# Altium schematic sheet FPGA_CONFIG.SchDoc
size A4
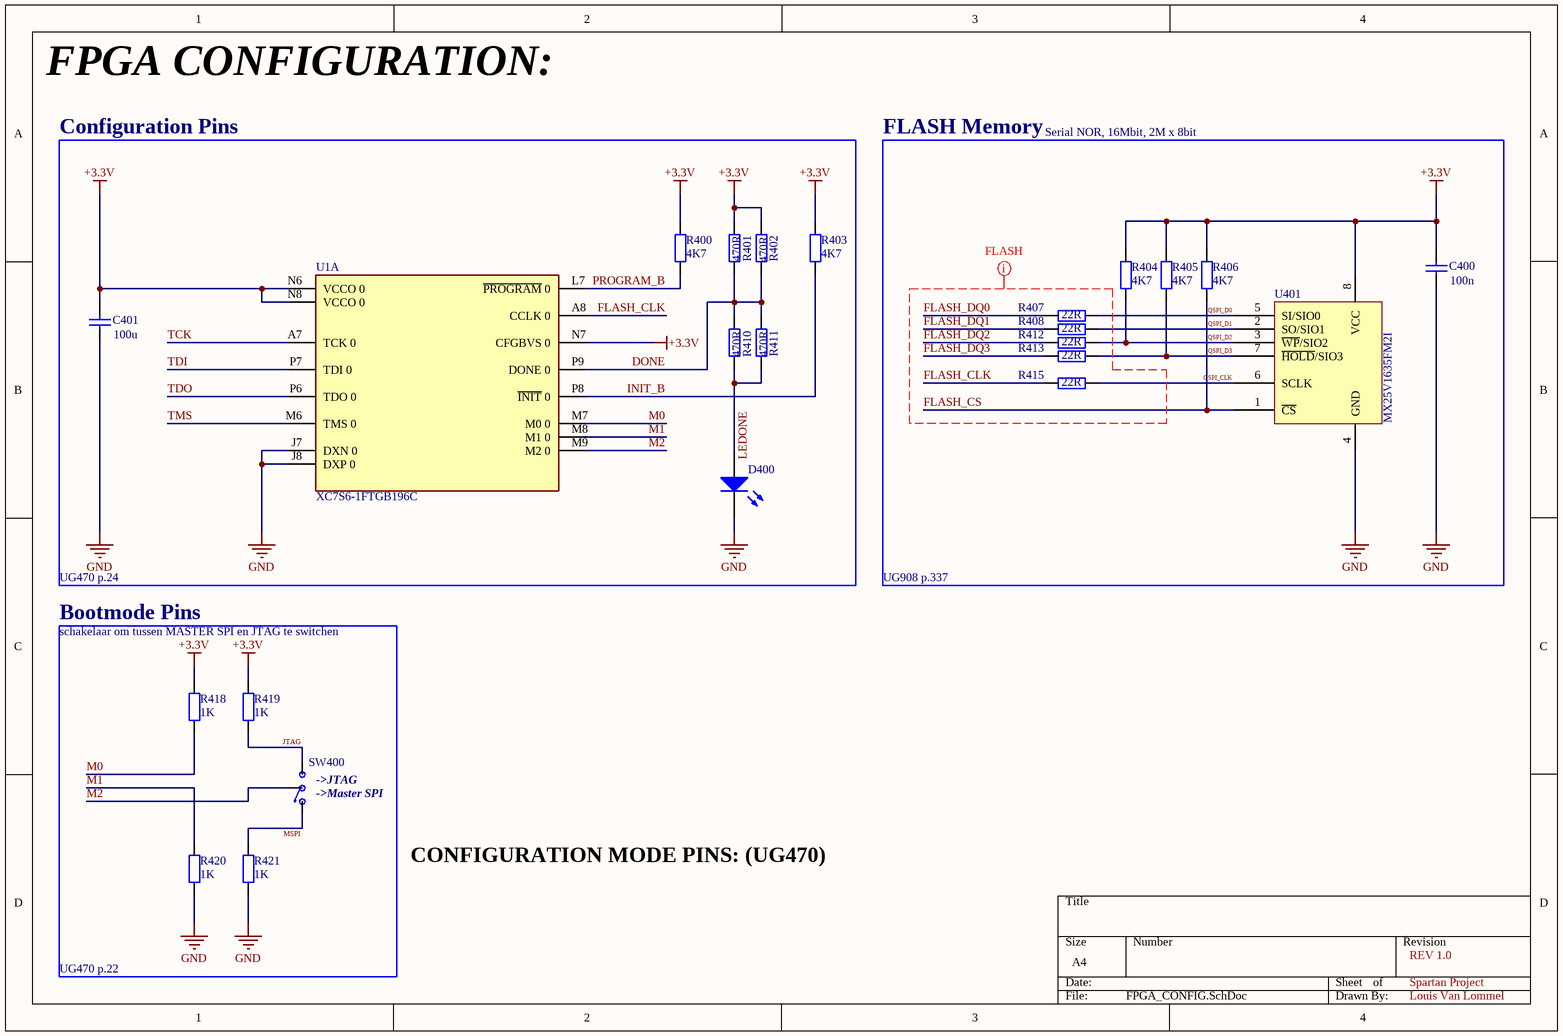
[diagram p0: FPGA_CONFIG.SchDoc]

## Parts
C400  100n  [CAP_0603]
C401  value 100u  [CAP_0805]  (hidden comment: 100uF)
D400  LED  [LED_0603]  (value not drawn)
R400  4K7  [RES_0603]
R401  value 470R  [RES_0603]  (hidden comment: 470)
R402  value 470R  [RES_0603]  (hidden comment: 470)
R403  4K7  [RES_0603]
R404  4K7  [RES_0603]
R405  4K7  [RES_0603]
R406  4K7  [RES_0603]
R407  value 22R  [RES_0603]  (hidden comment: 22)
R408  value 22R  [RES_0603]  (hidden comment: 22)
R410  value 470R  [RES_0603]  (hidden comment: 470)
R411  value 470R  [RES_0603]  (hidden comment: 470)
R412  value 22R  [RES_0603]  (hidden comment: 22)
R413  value 22R  [RES_0603]  (hidden comment: 22)
R415  value 22R  [RES_0603]  (hidden comment: 22)
R418  1K  [RES_0603]
R419  1K  [RES_0603]
R420  1K  [RES_0603]
R421  1K  [RES_0603]
SW400  SPDT SW  [SPDT SWITCH]  (value not drawn)
U1  XC7S6-1FTGB196C  [FP-XC7S6-1FTGB196C-MFG]  (part A of 4)
U401  MX25V1635FM2I  [SOP-8]

## Blocks framed on the sheet
Configuration Pins: C401 D400 R400-R403 R410 R411 U1
FLASH Memory: C400 R404-R408 R412 R413 R415 U401
Bootmode Pins: R418-R421 SW400

## Nets
+3.3V: C400.2 C401.2 R400.2 R401.2 R402.2 R403.2 R404.2 R405.2 R406.2 R418.2 R419.2 U1.N6(VCCO_0) U1.N7(CFGBVS_0) U1.N8(VCCO_0) U401.8(VCC)
GND: C400.1 C401.1 D400.2(K) R420.1 R421.1 U1.J7(DXN_0) U1.J8(DXP_0) U401.4(GND)
DONE: R401.1 R402.1 R410.2 R411.2 U1.P9(DONE_0)
FLASH_CLK: R415.2 U1.A8(CCLK_0)
FLASH_CS: R406.1 U401.1(~{CS})
FLASH_DQ0: R407.2
FLASH_DQ1: R408.2
FLASH_DQ2: R412.2
FLASH_DQ3: R413.2
INIT_B: R403.1 U1.P8(~{INIT}_0)
JTAG: R419.1 SW400.1
LEDONE: D400.1(A) R410.1 R411.1
M0: R418.1 U1.M7(M0_0)
M1: R420.2 U1.M8(M1_0)
M2: SW400.2 U1.M9(M2_0)
MSPI: R421.2 SW400.3
PROGRAM_B: R400.1 U1.L7(~{PROGRAM}_0)
QSPI_CLK: R415.1 U401.6(SCLK)
QSPI_D0: R407.1 U401.5(SI/SIO0)
QSPI_D1: R408.1 U401.2(SO/SIO1)
QSPI_D2: R404.1 R412.1 U401.3(~{WP}/SIO2)
QSPI_D3: R405.1 R413.1 U401.7(~{HOLD}/SIO3)
TCK: U1.A7(TCK_0)
TDI: U1.P7(TDI_0)
TDO: U1.P6(TDO_0)
TMS: U1.M6(TMS_0)

## Layout directives
mark named FLASH: FLASH_CLK, FLASH_CS, FLASH_DQ0, FLASH_DQ1, FLASH_DQ2, FLASH_DQ3

## Notes on the sheet
- FPGA CONFIGURATION:
- Serial NOR, 16Mbit, 2M x 8bit
- UG470 p.24
- UG908 p.337
- schakelaar om tussen MASTER SPI en JTAG te switchen
- (near SW400) ->JTAG
- (near SW400) ->Master SPI
- CONFIGURATION MODE PINS: (UG470)
- UG470 p.22
- REV 1.0
- Spartan Project
- Louis Van Lommel

## Library data of the parts
C400 C401 = Cap: Capacitor; Published: 8-Jun-2000; LatestRevisionDate: 17-Jul-2002; LatestRevisionNote: Re-released for DXP Platform.; PackageReference: RAD-0.3; Publisher: Altium Limited; PackageDescription: Radial Cap, Thru-Hole; 2 Leads; 0.3 in Pin Spacing
  C400: Value: 100n
D400 = LED0: Typical INFRARED GaAs LED; Published: 8-Jun-2000; LatestRevisionDate: 08-Jul-2005; LatestRevisionNote: Mech Layer 1 removed.; PackageReference: LED-0; Publisher: Altium Limited; PackageDescription: LED; 2 Leads
R400-R408 R410-R413 R415 R418-R421 = Res2: Resistor; Published: 8-Jun-2000; LatestRevisionDate: 17-Jul-2002; LatestRevisionNote: Re-released for DXP Platform.; PackageReference: AXIAL-0.4; Publisher: Altium Limited; PackageDescription: Axial Device, Thru-Hole; 2 Leads; 0.4 in Pin Spacing
  R400 R403-R406: Value: 4K7
  R418-R421: Value: 1K
U1 = CMP-17530-000008-1: Manufacturer: Xilinx; Standoff Height: 0.3mm; Max Supply Voltage: 3.465V; Number Of Logic Elements Cells: 6000; Number Of I/Os: 100; Min Supply Voltage: 0.95V; Ram Size: 180Kbits; Frequency: 200MHz; Max Junction Temp: +85°C; Speed Grade: 1; Propagation Delay: 0.13ns; Number Of Logic Blocks: 938; Lead Free: Yes; Device Class L1: Integrated Circuits (ICs); Category: IC; Ipc Land Pattern Name: BGA196C100P14X14_1500X1500X146; Manufacturer Part Number: XC7S6-1FTGB196C; Temperature Range High: +85°C; ComponentLink2Description: Datasheet; Package: XC7S6-1FTGB196C; Height: 1.55mm; Device Class L2: Embedded Processors and Controllers; Digikey Description: XC7S6-1FTGB196C; Temperature: 0°C to +85°C; Device Class L3: FPGAs - Field Programmable Gate Arrays; Automotive: No; Octopart: https://octopart.com/xc7s6-1ftgb196c-xilinx-81890684; Footprint Url: https://www.xilinx.com/support/documentation/user_guides/ug475_7Series_Pkg_Pinout.pdf; ComponentLink2URL: https://www.xilinx.com/support/documentation/data_sheets/ds189-spartan-7-data-sheet.pdf; RoHS: TRUE; Temperature Range Low: 0°C
U401 = MACRONIX MX25V1635FM2I: Flash Memory, Serial NOR, 16 Mbit, 2M x 8bit, SPI, SOP, 8 Pins